# EAGLE design standalone-nes-synth (EAGLE 5.10)
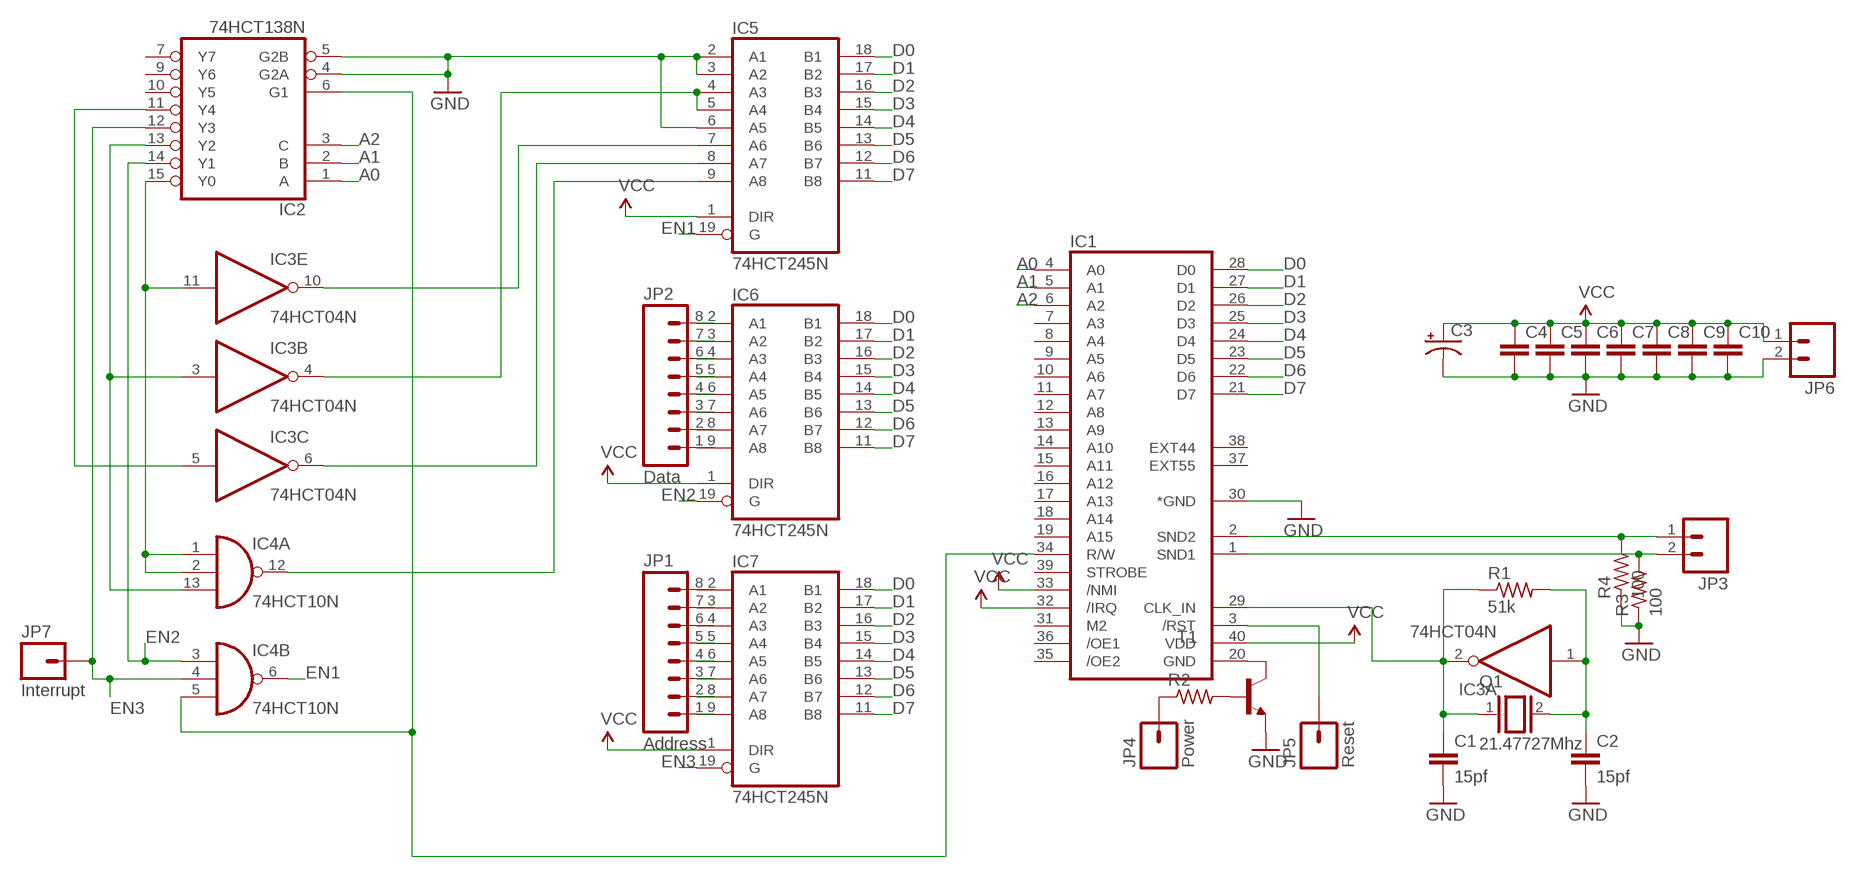
[diagram p0: schematic, sheet 1]

## Parts
C1  15pf  C-EU025-024X044  [C025-024X044]
C2  15pf  C-EU025-024X044  [C025-024X044]
C3  CPOL-USE5-8.5  [E5-8,5]
C4  C-EU025-030X050  [C025-030X050]
C5  C-EU025-030X050  [C025-030X050]
C6  C-EU025-030X050  [C025-030X050]
C7  C-EU025-030X050  [C025-030X050]
C8  C-EU025-030X050  [C025-030X050]
C9  C-EU025-030X050  [C025-030X050]
C10  C-EU025-030X050  [C025-030X050]
IC1  2A03  [DIL40]
IC2  74HCT138N  [DIL16]
IC3  74HCT04N  [DIL14]
IC4  74HCT10N  [DIL14]
IC5  74HCT245N  [DIL20]
IC6  74HCT245N  [DIL20]
IC7  74HCT245N  [DIL20]
JP1  Address  M08  [1X08]
JP2  Data  M08  [1X08]
JP3  M02PTH  [1X02]
JP4  Power  M01PTH  [1X01]
JP5  Reset  M01PTH  [1X01]
JP6  M02  [1X02_LONGPADS]
JP7  Interrupt  M01PTH  [1X01]
Q1  21.47727Mhz  XTAL  [Q]
R1  51k  R-US_0207/7  [0207/7]
R2  R-US_0207/7  [0207/7]
R3  100  R-US_0207/7  [0207/7]
R4  100  R-US_0207/7  [0207/7]
T1  2N2222-NPN-TO92-EBC  [TO92-EBC]

## Nets
A0: IC1.4(A0) IC2.1(A)
A1: IC1.5(A1) IC2.2(B)
A2: IC1.6(A2) IC2.3(C)
A3: IC3.4(B:O) IC5.4(A3) IC5.5(A4)
D0: IC1.28(D0) IC5.18(B1) IC6.18(B1) IC7.18(B1)
D1: IC1.27(D1) IC5.17(B2) IC6.17(B2) IC7.17(B2)
D2: IC1.26(D2) IC5.16(B3) IC6.16(B3) IC7.16(B3)
D3: IC1.25(D3) IC5.15(B4) IC6.15(B4) IC7.15(B4)
D4: IC1.24(D4) IC5.14(B5) IC6.14(B5) IC7.14(B5)
D5: IC1.23(D5) IC5.13(B6) IC6.13(B6) IC7.13(B6)
D6: IC1.22(D6) IC5.12(B7) IC6.12(B7) IC7.12(B7)
D7: IC1.21(D7) IC5.11(B8) IC6.11(B8) IC7.11(B8)
EN1: IC4.6(B:O) IC5.19(G)
EN2: IC2.14(Y1) IC4.3(B:I0) IC6.19(G)
EN3: IC2.12(Y3) IC4.4(B:I1) IC7.19(G) JP7.1
GND: C1.2 C2.2 C3.- C4.2 C5.2 C6.2 C7.2 C8.2 C9.2 C10.2 IC1.30(*GND) IC2.4(G2A) IC2.5(G2B) IC5.2(A1) IC5.3(A2) IC5.6(A5) JP6.2 R3.1 R4.1 T1.E
N$1: IC3.10(E:O) IC5.7(A6)
N$2: IC1.2(SND2) JP3.1 R4.2
N$3: IC3.6(C:O) IC5.8(A7)
N$4: IC2.15(Y0) IC3.11(E:I) IC4.1(A:I0) IC4.2(A:I1)
N$5: IC4.12(A:O) IC5.9(A8)
N$6: IC2.13(Y2) IC3.3(B:I) IC4.13(A:I2)
N$7: IC6.9(A8) JP2.1
N$8: IC2.11(Y4) IC3.5(C:I)
N$9: IC1.34(R/W) IC2.6(G1) IC4.5(B:I2)
N$10: IC6.8(A7) JP2.2
N$11: IC6.7(A6) JP2.3
N$12: IC6.6(A5) JP2.4
N$13: IC6.5(A4) JP2.5
N$14: IC6.4(A3) JP2.6
N$15: IC6.3(A2) JP2.7
N$16: IC6.2(A1) JP2.8
N$17: IC7.9(A8) JP1.1
N$18: IC7.8(A7) JP1.2
N$19: IC7.7(A6) JP1.3
N$20: IC7.6(A5) JP1.4
N$21: IC7.5(A4) JP1.5
N$22: IC7.4(A3) JP1.6
N$23: IC7.3(A2) JP1.7
N$24: IC7.2(A1) JP1.8
N$25: IC1.1(SND1) JP3.2 R3.2
N$26: IC1.20(GND) T1.C
N$27: R2.2 T1.B
N$28: C1.1 IC1.29(CLK_IN) IC3.2(A:O) Q1.1 R1.1
N$29: C2.1 IC3.1(A:I) Q1.2 R1.2
N$30: JP4.1 R2.1
N$31: IC1.3(/RST) JP5.1
VCC: C3.+ C4.1 C5.1 C6.1 C7.1 C8.1 C9.1 C10.1 IC1.32(/IRQ) IC1.33(/NMI) IC1.40(VDD) IC5.1(DIR) IC6.1(DIR) IC7.1(DIR) JP6.1
Unconnected: IC1.7(A3) IC1.8(A4) IC1.9(A5) IC1.10(A6) IC1.11(A7) IC1.12(A8) IC1.13(A9) IC1.14(A10) IC1.15(A11) IC1.16(A12) IC1.17(A13) IC1.18(A14) IC1.19(A15) IC1.31(M2) IC1.35(/OE2) IC1.36(/OE1) IC1.37(EXT55) IC1.38(EXT44) IC1.39(STROBE) IC2.7(Y7) IC2.9(Y6) IC2.10(Y5) IC3.8(D:O) IC3.9(D:I) IC3.12(F:O) IC3.13(F:I) IC4.8(C:O) IC4.9(C:I0) IC4.10(C:I1) IC4.11(C:I2)

## Power pins joined to a net without a drawn wire
GND: IC2.8(GND) IC3.7(P:GND) IC4.7(P:GND) IC5.10(GND) IC6.10(GND) IC7.10(GND)
VCC: IC2.16(VCC) IC3.14(P:VCC) IC4.14(P:VCC) IC5.20(VCC) IC6.20(VCC) IC7.20(VCC)

## Library data of the parts
C1 C2 C4-C10 = rcl:C-EU: CAPACITOR, European symbol
C3 = rcl:CPOL-US: POLARIZED CAPACITOR, American symbol
IC1 = nin:2A03: MICROCONTROLLER
IC2 = 74xx-eu:74*138: 3-line to 8-line DECODER/DEMULTIPLEXER
IC3 = 74xx-eu:74*04: Hex INVERTER
IC4 = 74xx-eu:74*10: Triple 3-input NAND gate
IC5-IC7 = 74xx-eu:74*245: Octal BUS TRANSCEIVER, 3-state
JP1 JP2 = SparkFun:M08: Header 8 Standard 8-pin 0.1" header. Use with straight break away headers (SKU : PRT-00116), right angle break away headers (PRT-00553), swiss pins (PRT-00743), machine pins (PRT-00117), and female headers (PRT-00115).
JP3 JP6 = SparkFun:M02: Header 2 Standard 2-pin 0.1" header. Use with straight break away headers (SKU : PRT-00116), right angle break away headers (PRT-00553), swiss pins (PRT-00743), machine pins (PRT-00117), and female headers (PRT-00115). Molex polarized connector foot print use with SKU : PRT-08233 with associated crimp pins and housings.
JP4 JP5 JP7 = SparkFun:M01: Header 1 Standard 1-pin 0.1" header. Use with straight break away headers (SKU : PRT-00116), right angle break away headers (PRT-00553), swiss pins (PRT-00743), machine pins (PRT-00117), and female headers (PRT-00115).
Q1 = special:XTAL: CRYSTAL
R1-R4 = resistor:R-US_: RESISTOR, American symbol
T1 = transistor-neu-to92:*-NPN-: NPN Transistror

## Board
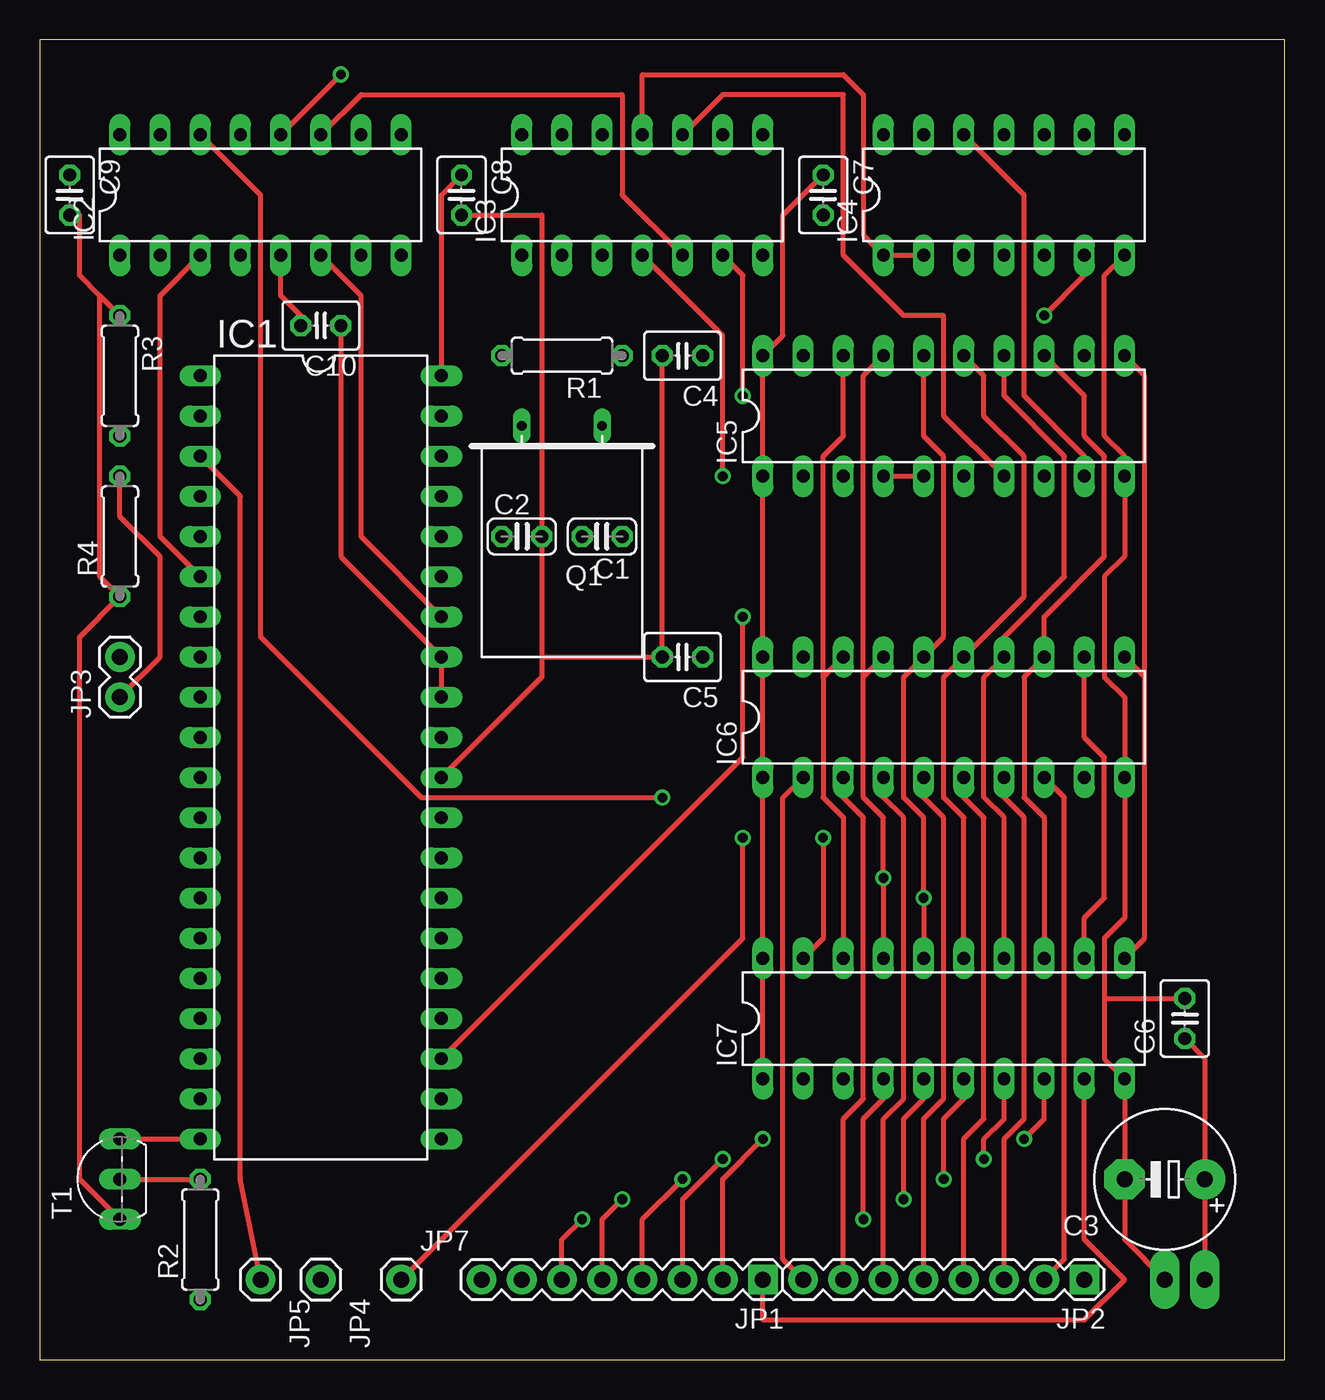
[diagram p1: board, top side]
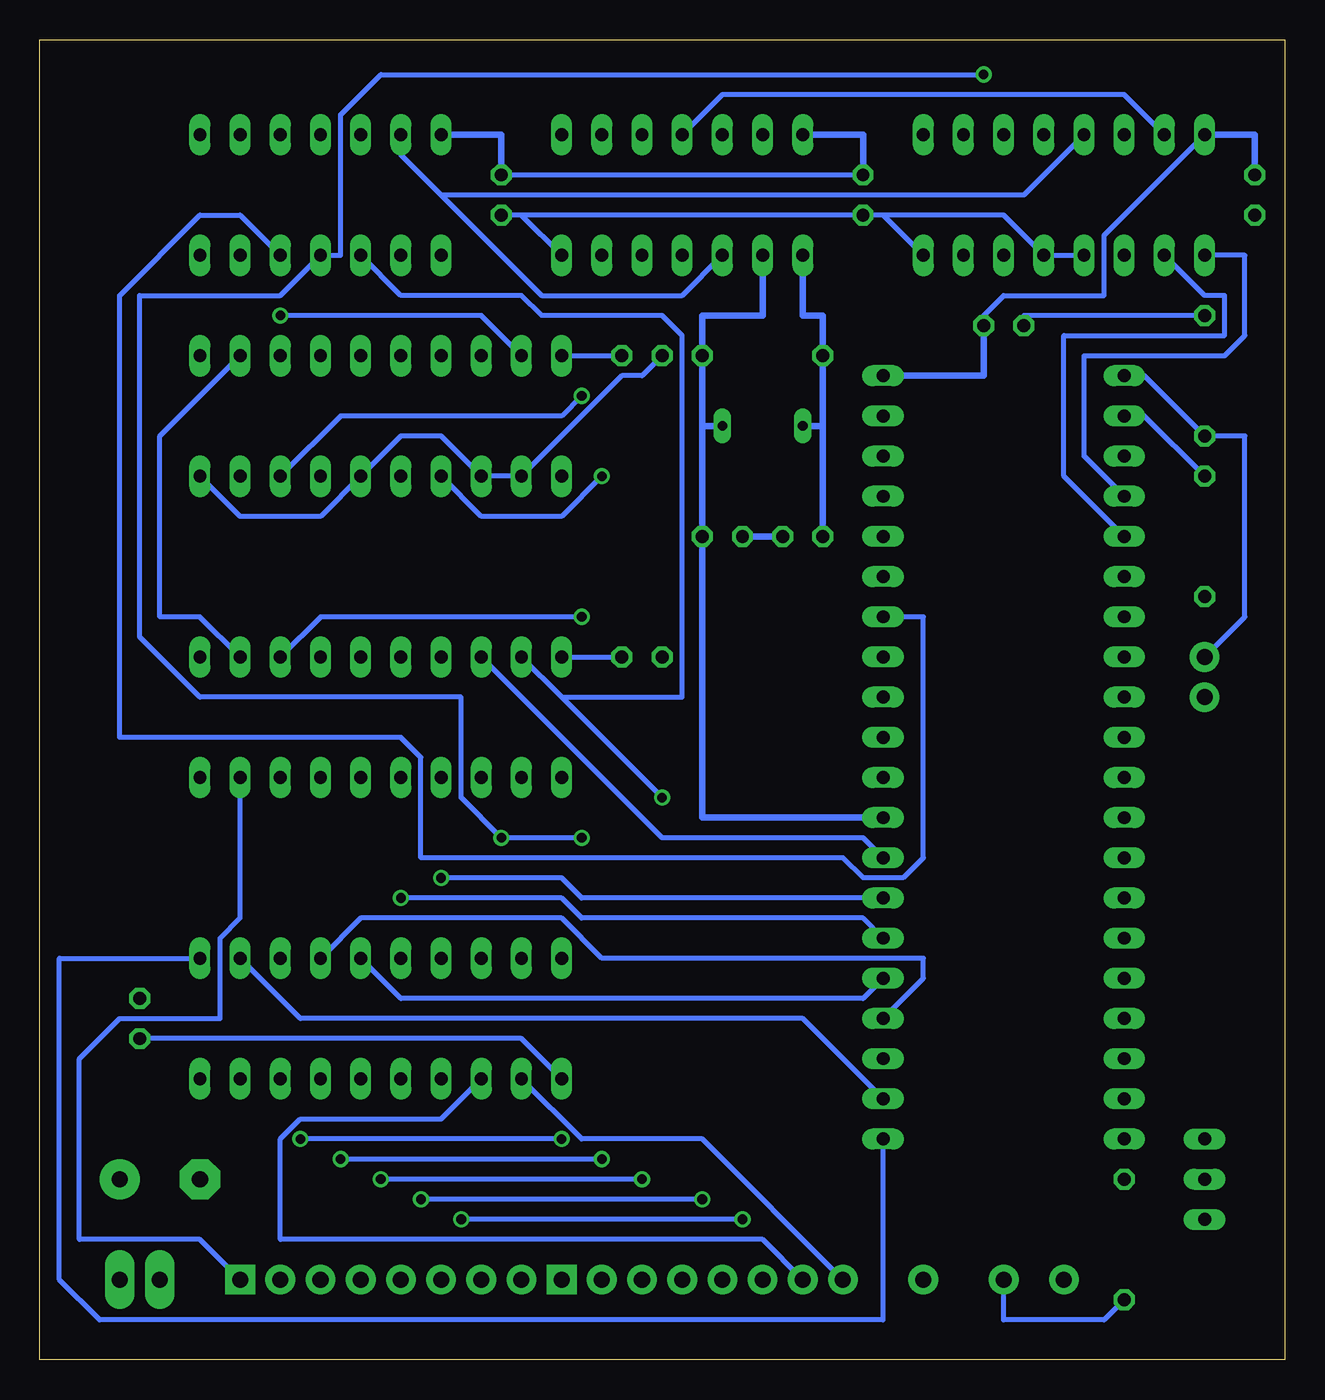
[diagram p2: board, bottom side, seen from below]

Size 78.72 x 83.49 mm. Coordinates in mm from the lower left corner, seen from the top.
Outline: 0,0 78.72,0 78.72,83.49 0,83.49 0,0
Copper layers (1*16): Top 0.035mm / dielectric 1.5mm / Bottom 0.035mm
Design rules "default *": minimum track width 12mil, minimum drill 24mil, track to track 8mil, track to pad 8mil, pad to pad 8mil, via to via 8mil, smd to smd 8mil, copper to edge 40mil, drill to drill 8mil, minimum pad ring 10mil, minimum via ring 8mil, stop-mask expansion 4mil, vias tented up to drill 0mil, thermal gap 10mil

### Footprints (pad centres in the part's own frame; a part is rotated, then mirrored left to right if it is on the bottom)
C025-024X044 = drill 0.813 octagon: 1 -1.27,0; 2 1.27,0
E5-8,5 = drill 1.016 pad 2.54 round: + -2.54,0 | drill 1.016 pad 2.54 octagon: - 2.54,0
C025-030X050 = drill 0.813 octagon: 1 -1.27,0; 2 1.27,0
DIL40 = drill 0.813 long: 1 -24.13,-7.62; 2 -21.59,-7.62; 3 -19.05,-7.62; 4 -16.51,-7.62; 5 -13.97,-7.62; 6 -11.43,-7.62; 7 -8.89,-7.62; 8 -6.35,-7.62; 9 -3.81,-7.62; 10 -1.27,-7.62; 11 1.27,-7.62; 12 3.81,-7.62; 13 6.35,-7.62; 14 8.89,-7.62; 15 11.43,-7.62; 16 13.97,-7.62; 17 16.51,-7.62; 18 19.05,-7.62; 19 21.59,-7.62; 20 24.13,-7.62; 21 24.13,7.62; 22 21.59,7.62; 23 19.05,7.62; 24 16.51,7.62; 25 13.97,7.62; 26 11.43,7.62; 27 8.89,7.62; 28 6.35,7.62; 29 3.81,7.62; 30 1.27,7.62; 31 -1.27,7.62; 32 -3.81,7.62; 33 -6.35,7.62; 34 -8.89,7.62; 35 -11.43,7.62; 36 -13.97,7.62; 37 -16.51,7.62; 38 -19.05,7.62; 39 -21.59,7.62; 40 -24.13,7.62
DIL16 = drill 0.813 long: 1 -8.89,-3.81; 2 -6.35,-3.81; 3 -3.81,-3.81; 4 -1.27,-3.81; 5 1.27,-3.81; 6 3.81,-3.81; 7 6.35,-3.81; 8 8.89,-3.81; 9 8.89,3.81; 10 6.35,3.81; 11 3.81,3.81; 12 1.27,3.81; 13 -1.27,3.81; 14 -3.81,3.81; 15 -6.35,3.81; 16 -8.89,3.81
DIL14 = drill 0.813 long: 1 -7.62,-3.81; 2 -5.08,-3.81; 3 -2.54,-3.81; 4 0,-3.81; 5 2.54,-3.81; 6 5.08,-3.81; 7 7.62,-3.81; 8 7.62,3.81; 9 5.08,3.81; 10 2.54,3.81; 11 0,3.81; 12 -2.54,3.81; 13 -5.08,3.81; 14 -7.62,3.81
DIL20 = drill 0.813 long: 1 -11.43,-3.81; 2 -8.89,-3.81; 3 -6.35,-3.81; 4 -3.81,-3.81; 5 -1.27,-3.81; 6 1.27,-3.81; 7 3.81,-3.81; 8 6.35,-3.81; 9 8.89,-3.81; 10 11.43,-3.81; 11 11.43,3.81; 12 8.89,3.81; 13 6.35,3.81; 14 3.81,3.81; 15 1.27,3.81; 16 -1.27,3.81; 17 -3.81,3.81; 18 -6.35,3.81; 19 -8.89,3.81; 20 -11.43,3.81
1X08 = drill 1.016 pad 1.88 square: 1 0,0 | drill 1.016 pad 1.88 round: 2 2.54,0; 3 5.08,0; 4 7.62,0; 5 10.16,0; 6 12.7,0; 7 15.24,0; 8 17.78,0
1X02 = drill 1.016 pad 1.88 round: 1 0,0; 2 2.54,0
1X01 = drill 1.016 pad 1.88 round: 1 0,0
1X02_LONGPADS = drill 1.016 pad 1.88 long: 1 0,0; 2 2.54,0
Q = drill 0.61 long: 1 -2.54,-7.62; 2 2.54,-7.62
0207/7 = drill 0.813 octagon: 1 -3.81,0; 2 3.81,0
TO92-EBC = drill 0.813 long: B 0,-1.27; C 2.54,-1.27; E -2.54,-1.27

### Placement (x,y rotation side)
C1  35.56,52.07 180 top
C2  30.48,52.07 0 top
C3  71.12,11.43 180 top
C4  40.64,63.5 180 top
C5  40.64,44.45 180 top
C6  72.39,21.59 90 top
C7  49.53,73.66 270 top
C8  26.67,73.66 270 top
C9  1.91,73.66 270 top
C10  17.78,65.41 180 top
IC1  17.78,38.1 270 top
IC2  13.97,73.66 0 top
IC3  38.1,73.66 0 top
IC4  60.96,73.66 0 top
IC5  57.15,59.69 0 top
IC6  57.15,40.64 0 top
IC7  57.15,21.59 0 top
JP1  45.72,5.08 180 top
JP2  66.04,5.08 180 top
JP3  5.08,41.91 90 top
JP4  17.78,5.08 270 top
JP5  13.97,5.08 270 top
JP6  73.66,5.08 180 top
JP7  22.86,5.08 0 top
Q1  33.02,51.44 180 top
R1  33.02,63.5 180 top
R2  10.16,7.62 90 top
R3  5.08,62.23 270 top
R4  5.08,52.07 90 top
T1  3.81,11.43 90 top

### Tracks (layer width: path | path; a pad name or v marks a point on that pad's centre or on a via)
A0
  Bottom 0.305: IC1.4 12.7,57.15 12.7,63.5 3.81,63.5 2.54,64.77 2.54,69.85 IC2.1
A1
  Bottom 0.305: IC1.5 13.97,55.88 13.97,64.77 3.81,64.77 3.81,67.31 5.08,67.31 IC2.2
A2
  Top 0.305: IC1.6 7.62,52.07 7.62,67.31 IC2.3
A3  (via drill 0.61)
  Top 0.305: IC5.4 IC5.5 | IC3.4 43.18,64.77 v43.18,55.88
  Bottom 0.305: v43.18,55.88 45.72,53.34 50.8,53.34 IC5.4
D0
  Top 0.305: IC7.18 50.8,34.29 49.53,35.56 49.53,43.18 | IC6.18 49.53,43.18 | IC5.18 50.8,58.42 49.53,57.15 49.53,43.18
  Bottom 0.305: IC1.28 26.67,33.02 39.37,33.02 IC6.18
D1  (via drill 0.61)
  Top 0.305: IC7.17 v53.34,30.48 53.34,34.29 52.07,35.56 52.07,43.18 | 52.07,43.18 IC6.17 | IC5.17 52.07,62.23 52.07,43.18
  Bottom 0.305: IC1.27 44.45,29.21 45.72,30.48 v53.34,30.48
D2  (via drill 0.61)
  Top 0.305: IC7.16 v55.88,29.21 55.88,34.29 54.61,35.56 54.61,43.18 IC6.16 57.15,45.72 57.15,57.15 55.88,58.42 IC5.16
  Bottom 0.305: IC1.26 26.67,27.94 44.45,27.94 45.72,29.21 v55.88,29.21
D3
  Top 0.305: IC7.15 58.42,34.29 57.15,35.56 57.15,43.18 IC6.15 62.23,48.26 62.23,57.15 59.69,59.69 59.69,62.23 IC5.15
  Bottom 0.305: IC1.25 26.67,22.86 55.88,22.86 IC7.15
D4
  Top 0.305: IC7.14 60.96,34.29 59.69,35.56 59.69,43.18 IC6.14 60.96,45.72 64.77,49.53 64.77,57.15 60.96,60.96 IC5.14
  Bottom 0.305: IC1.24 22.86,24.13 22.86,25.4 43.18,25.4 45.72,27.94 58.42,27.94 IC7.14
D5  (via drill 0.61)
  Top 0.305: IC1.23 44.45,38.1 v44.45,46.99 | IC7.13 63.5,34.29 62.23,35.56 62.23,43.18 IC6.13 63.5,46.99 67.31,50.8 67.31,57.15 66.04,58.42 66.04,60.96 IC5.13
  Bottom 0.305: v44.45,46.99 60.96,46.99 IC6.13
D6
  Top 0.305: IC6.12 66.04,39.37 67.31,38.1 67.31,29.21 66.04,27.94 IC7.12
  Bottom 0.305: IC1.22 30.48,21.59 62.23,21.59 IC7.12 | IC5.12 71.12,58.42 71.12,46.99 68.58,46.99 IC6.12
D7
  Top 0.305: 69.85,43.18 IC6.11 | 69.85,43.18 69.85,26.67 IC7.11 | IC5.11 69.85,62.23 69.85,43.18
  Bottom 0.305: IC1.21 25.4,2.54 74.93,2.54 77.47,5.08 77.47,25.4 IC7.11
EN1  (via drill 0.61)
  Top 0.305: v63.5,66.04 66.04,68.58 IC4.6
  Bottom 0.305: IC5.19 50.8,66.04 v63.5,66.04
EN2  (via drill 0.61)
  Top 0.305: IC2.14 13.97,73.66 13.97,45.72 24.13,35.56 v39.37,35.56
  Bottom 0.305: 45.72,41.91 IC6.19 | v39.37,35.56 45.72,41.91 | IC4.3 55.88,67.31 48.26,67.31 46.99,66.04 39.37,66.04 38.1,64.77 38.1,41.91 45.72,41.91
EN3  (via drill 0.61)
  Top 0.305: IC7.19 49.53,26.67 v49.53,33.02 | v19.05,81.28 IC2.12 | JP7.1 44.45,26.67 v44.45,33.02
  Bottom 0.305: v19.05,81.28 57.15,81.28 59.69,78.74 59.69,69.85 IC4.4 63.5,67.31 72.39,67.31 72.39,45.72 68.58,41.91 52.07,41.91 52.07,35.56 v49.53,33.02 v44.45,33.02
GND
  Top 0.305: T1.E 2.54,11.43 2.54,45.72 R4.1 3.81,49.53 3.81,67.31 | 3.81,67.31 2.54,68.58 2.54,72.39 C9.2 | 3.81,67.31 R3.1 | IC2.5 15.24,67.31 16.51,66.04 C10.2 | 67.31,22.86 67.31,19.05 IC7.10 C3.- 68.58,7.62 JP6.2 | 67.31,22.86 67.31,26.67 68.58,27.94 IC6.10 68.58,41.91 67.31,43.18 67.31,49.53 68.58,50.8 IC5.10 68.58,57.15 67.31,58.42 67.31,68.58 IC4.7 | 67.31,22.86 C6.2 | IC1.30 31.75,43.18 31.75,44.45 | 31.75,44.45 C2.2 31.75,72.39 C8.2 | 31.75,44.45 C5.2 C4.2
  Bottom 0.305: IC2.4 IC2.5 17.78,72.39 25.4,72.39 | 25.4,72.39 IC2.8 | 25.4,72.39 C8.2 48.26,72.39 | 48.26,72.39 IC3.7 | 48.26,72.39 C7.2 | R3.1 16.51,66.04 C10.2 | IC5.10 66.04,53.34 60.96,53.34 IC5.6 55.88,58.42 53.34,58.42 IC5.3 IC5.2 41.91,62.23 40.64,62.23 C4.2
  Bottom 0.406: C2.2 C1.2
N$1
  Top 0.305: IC3.10 43.18,80.01 50.8,80.01 50.8,69.85 54.61,66.04 57.15,66.04 57.15,59.69 IC5.7
N$2
  Top 0.305: JP3.1 7.62,44.45 7.62,50.8 5.08,53.34 R4.2
  Bottom 0.305: R4.2 8.89,59.69 IC1.2
N$3  (via drill 0.61)
  Top 0.305: IC3.6 44.45,68.58 v44.45,60.96
  Bottom 0.305: v44.45,60.96 45.72,59.69 59.69,59.69 IC5.8
N$4
  Top 0.305: IC4.2 IC4.1 52.07,71.12 52.07,80.01 50.8,81.28 38.1,81.28 IC3.11
  Bottom 0.305: IC2.15 10.16,80.01 35.56,80.01 IC3.11
N$5
  Top 0.305: IC5.9 66.04,57.15 62.23,60.96 62.23,73.66 IC4.12
N$6
  Bottom 0.305: IC3.3 38.1,67.31 46.99,67.31 53.34,73.66 | 53.34,73.66 55.88,76.2 IC4.13 | IC2.13 16.51,73.66 53.34,73.66
N$7
  Bottom 0.305: IC6.9 66.04,27.94 67.31,26.67 67.31,21.59 73.66,21.59 76.2,19.05 76.2,7.62 68.58,7.62 JP2.1
N$8
  Top 0.305: IC2.11 20.32,80.01 36.83,80.01 36.83,73.66 IC3.5
N$9
  Top 0.305: IC1.34 20.32,52.07 20.32,67.31 IC2.6
  Bottom 0.305: IC4.5 66.04,72.39 68.58,72.39 73.66,67.31 73.66,39.37 55.88,39.37 54.61,38.1 54.61,31.75 27.94,31.75 26.67,30.48 24.13,30.48 22.86,31.75 22.86,46.99 IC1.34
N$10
  Top 0.305: IC6.8 64.77,35.56 64.77,6.35 JP2.2
N$11
  Top 0.305: IC6.7 60.96,35.56 62.23,34.29 62.23,15.24 60.96,13.97 JP2.3
N$12
  Top 0.305: IC6.6 58.42,35.56 59.69,34.29 59.69,15.24 58.42,13.97 JP2.4
N$13
  Top 0.305: IC6.5 55.88,35.56 57.15,34.29 57.15,16.51 55.88,15.24 JP2.5
N$14
  Top 0.305: IC6.4 53.34,35.56 54.61,34.29 54.61,16.51 53.34,15.24 JP2.6
N$15
  Top 0.305: IC6.3 50.8,35.56 52.07,34.29 52.07,16.51 50.8,15.24 JP2.7
N$16
  Top 0.305: IC6.2 46.99,35.56 46.99,6.35 JP2.8
N$17
  Top 0.305: IC7.9 66.04,7.62 68.58,5.08 66.04,2.54 45.72,2.54 JP1.1
N$18  (via drill 0.61)
  Top 0.305: IC7.8 63.5,15.24 v62.23,13.97 | v45.72,13.97 43.18,11.43 JP1.2
  Bottom 0.305: v45.72,13.97 v62.23,13.97
N$19  (via drill 0.61)
  Top 0.305: IC7.7 60.96,15.24 59.69,13.97 v59.69,12.7 | v43.18,12.7 40.64,10.16 JP1.3
  Bottom 0.305: v43.18,12.7 v59.69,12.7
N$20  (via drill 0.61)
  Top 0.305: IC7.6 58.42,16.51 57.15,15.24 v57.15,11.43 | v40.64,11.43 38.1,8.89 JP1.4
  Bottom 0.305: v40.64,11.43 v57.15,11.43
N$21  (via drill 0.61)
  Top 0.305: IC7.5 55.88,16.51 54.61,15.24 v54.61,10.16 | v36.83,10.16 35.56,8.89 JP1.5
  Bottom 0.305: v36.83,10.16 v54.61,10.16
N$22  (via drill 0.61)
  Top 0.305: IC7.4 53.34,16.51 52.07,15.24 v52.07,8.89 | v34.29,8.89 33.02,7.62 JP1.6
  Bottom 0.305: v34.29,8.89 v52.07,8.89
N$23
  Bottom 0.305: IC7.3 53.34,15.24 62.23,15.24 63.5,13.97 63.5,7.62 33.02,7.62 JP1.7
N$24
  Bottom 0.305: IC7.2 44.45,13.97 36.83,13.97 JP1.8
N$25
  Bottom 0.305: IC1.1 8.89,62.23 R3.2 2.54,58.42 2.54,46.99 JP3.2
N$26
  Top 0.305: T1.C IC1.20
N$27
  Top 0.305: T1.B R2.2
N$28
  Bottom 0.406: IC3.2 33.02,66.04 36.83,66.04 R1.1 36.83,59.05 | IC1.29 36.83,34.29 C1.1 36.83,59.05 | 36.83,59.05 Q1.1
N$29
  Bottom 0.406: 29.21,59.05 R1.2 29.21,66.04 30.48,66.04 IC3.1 | 29.21,59.05 Q1.2 | C2.1 29.21,59.05
N$30
  Bottom 0.305: R2.1 11.43,2.54 17.78,2.54 JP4.1
N$31
  Top 0.305: IC1.3 12.7,54.61 12.7,11.43 JP5.1
VCC
  Top 0.305: IC1.32 IC1.33 19.05,50.8 C10.1 | C8.1 25.4,73.66 IC1.40 | C6.1 73.66,19.05 C3.+ JP6.1 | IC7.1 IC7.20 IC6.1 IC6.20 IC5.1 IC5.20 46.99,64.77 46.99,72.39 C7.1
  Bottom 0.305: IC2.16 11.43,71.12 11.43,67.31 17.78,67.31 19.05,66.04 C10.1 | C7.1 C8.1 | IC5.20 C4.1 | IC6.20 C5.1 | C6.1 48.26,20.32 IC7.1
  Bottom 0.406: IC3.14 26.67,77.47 C8.1 | IC4.14 49.53,77.47 C7.1 | IC2.16 1.91,77.47 C9.1 | C10.1 19.05,62.23 IC1.40